# Altium schematic sheet CW308T_LPC55S69_Main.SchDoc: UFO Target
size Letter; Organization: NewAE Technology Inc.; Address1: 1083 Queen St., Suite 196; Address2: Halifax; Address3: NS; Address4: Canada B3H 0B2; SheetApproved: YES
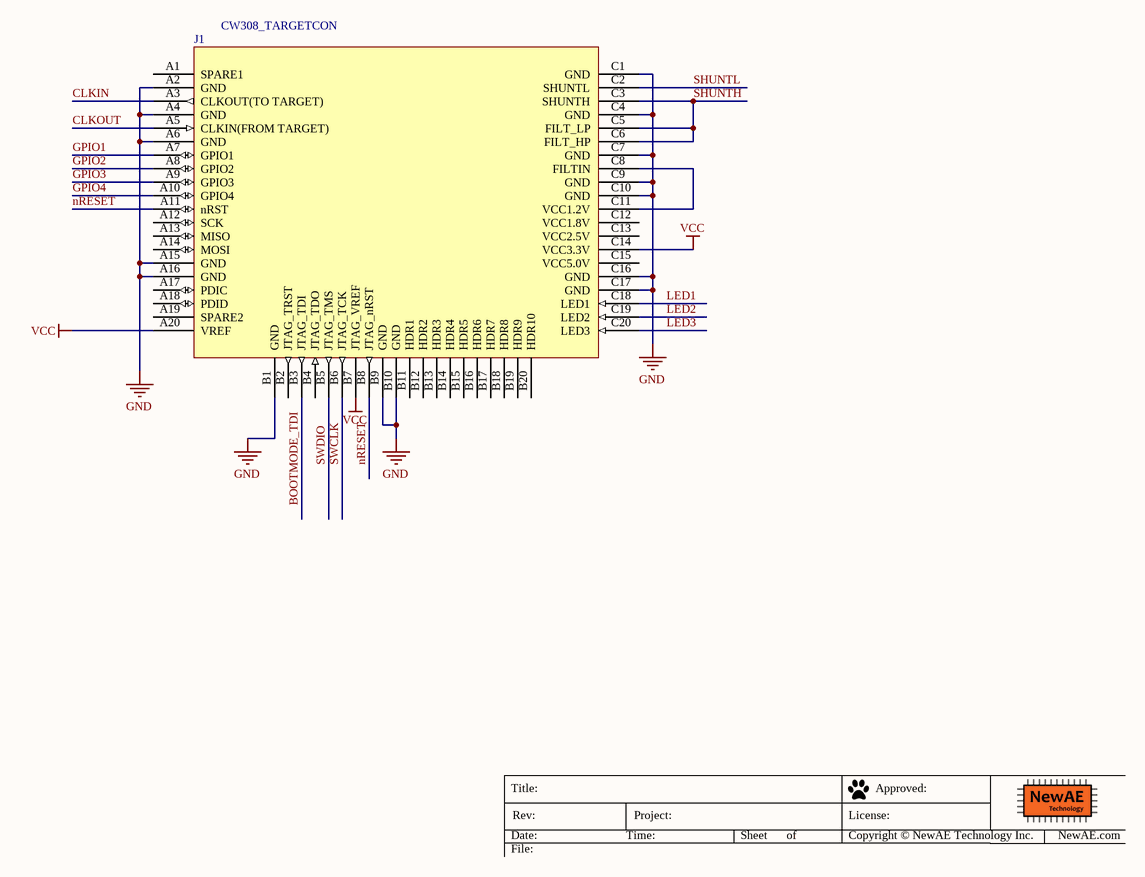
[diagram p0: CW308T_LPC55S69_Main.SchDoc]

## Parts
J1  CW308_TARGETCON  [CW308_TBOARD_CONN]

## Nets
GND: J1.A2(GND) J1.A4(GND) J1.A6(GND) J1.A15(GND) J1.A16(GND) J1.B1(GND) J1.B9(GND) J1.B10(GND) J1.C1(GND) J1.C4(GND) J1.C7(GND) J1.C9(GND) J1.C10(GND) J1.C16(GND) J1.C17(GND)
VCC: J1.A20(VREF) J1.B7(JTAG_VREF) J1.C14(VCC3.3V)
BOOTMODE_TDI: J1.B3(JTAG_TDI)
CLKIN: J1.A3(CLKOUT(TO_TARGET))
CLKOUT: J1.A5(CLKIN(FROM_TARGET))
GPIO1: J1.A7(GPIO1)
GPIO2: J1.A8(GPIO2)
GPIO3: J1.A9(GPIO3)
GPIO4: J1.A10(GPIO4)
LED1: J1.C18(LED1)
LED2: J1.C19(LED2)
LED3: J1.C20(LED3)
nRESET: J1.A11(nRST) J1.B8(JTAG_nRST)
SHUNTH: J1.C3(SHUNTH) J1.C5(FILT_LP) J1.C6(FILT_HP)
SHUNTL: J1.C2(SHUNTL)
SWCLK: J1.B6(JTAG_TCK)
SWDIO: J1.B5(JTAG_TMS)
NetJ1_C8: J1.C8(FILTIN) J1.C11(VCC1.2V)

Not connected (* = marked no-connect by the designer): J1 A1(SPARE1) A12(SCK) A13(MISO) A14(MOSI) A17(PDIC) A18(PDID) A19(SPARE2) B2(JTAG_TRST) B4(JTAG_TDO) B11(HDR1) B12(HDR2) B13(HDR3) B14(HDR4) B15(HDR5) B16(HDR6) B17(HDR7) B18(HDR8) B19(HDR9) B20(HDR10) C12(VCC1.8V) C13(VCC2.5V) C15(VCC5.0V)

## Notes on the sheet
- Title:
- Date:
- Rev:
- Time:
- Project:
- Sheet
- of
- License:
- Copyright © NewAE Technology Inc.
- Approved:
- NewAE.com
- File:

## Library data of the parts
J1 = CW308_TBOARD: CW308 "Standard" Target Board Connector; Component Group: Mechanical; Pitch: 2.54mm; Part Number: CW308_TBOARD; Pin Count: 60; Mounting Technology: Through-hole; Component Kind: Standard; Component Type: Standard